# Altium schematic sheet Sheet1.SchDoc
size A4; SheetNumber: 1; SheetTotal: 1
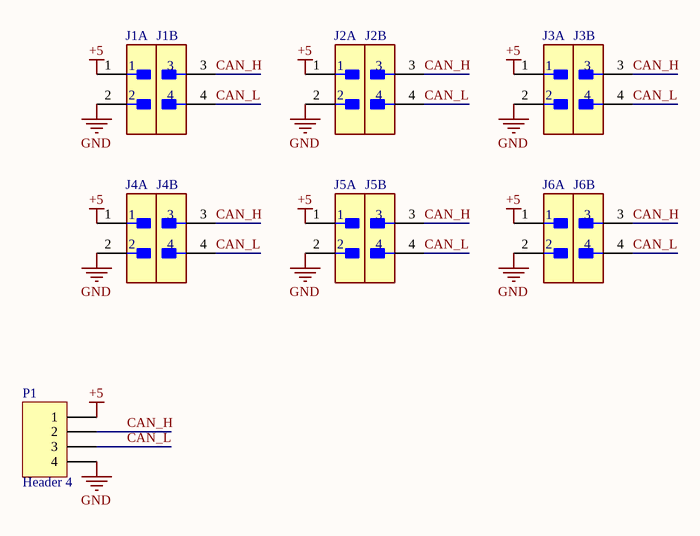
[diagram p0: Sheet1.SchDoc]

## Parts
J1  43045-0427  [FP-43045-0427-MFG]  (value not drawn)  (parts A,B of 2)
J2  43045-0427  [FP-43045-0427-MFG]  (value not drawn)  (parts A,B of 2)
J3  43045-0427  [FP-43045-0427-MFG]  (value not drawn)  (parts A,B of 2)
J4  43045-0427  [FP-43045-0427-MFG]  (value not drawn)  (parts A,B of 2)
J5  43045-0427  [FP-43045-0427-MFG]  (value not drawn)  (parts A,B of 2)
J6  43045-0427  [FP-43045-0427-MFG]  (value not drawn)  (parts A,B of 2)
P1  Header 4  [HDR1X4]

## Nets
+5: J1.1 J2.1 J3.1 J4.1 J5.1 J6.1 P1.1
GND: J1.2 J2.2 J3.2 J4.2 J5.2 J6.2 P1.4
CAN_H: J1.3 J2.3 J3.3 J4.3 J5.3 J6.3 P1.2
CAN_L: J1.4 J2.4 J3.4 J4.4 J5.4 J6.4 P1.3

## Library data of the parts
J1-J6 = CMP-04776-000336-1: CONN HEADER VERT 4POS 3MM; Glow Wire Compliant: Compliant; Contact Resistance: 10mR; Current Rating: 5A; Voltage Rating: 600V; Number of Contacts: 4; Max Voltage Rating (DC): 250.25kV; Number of Rows: 2; Max Operating Temperature: 105°C; Series: 43045; Package Quantity: 2232; Packaging: Tray; Mount: Through Hole; Pitch: 3mm; REACH SVHC: No SVHC; Row Spacing: 3mm; Contact Plating: Tin; Halogen Free: Low Halogen; Number of Positions: 4; Termination: Solder; Number of Circuits: 4; Radiation Hardening: No; Orientation: Vertical; Min Operating Temperature: -40°C; Contact Material: Brass; Housing Material: Thermoplastic
P1 = Header 4: Header, 4-Pin; LatestRevisionDate: 17-Jul-2002; LatestRevisionNote: Re-released for DXP Platform.; Publisher: Altium Limited